# Altium schematic sheet CAN.SchDoc
size A4; SheetNumber: 5; SheetTotal: 6
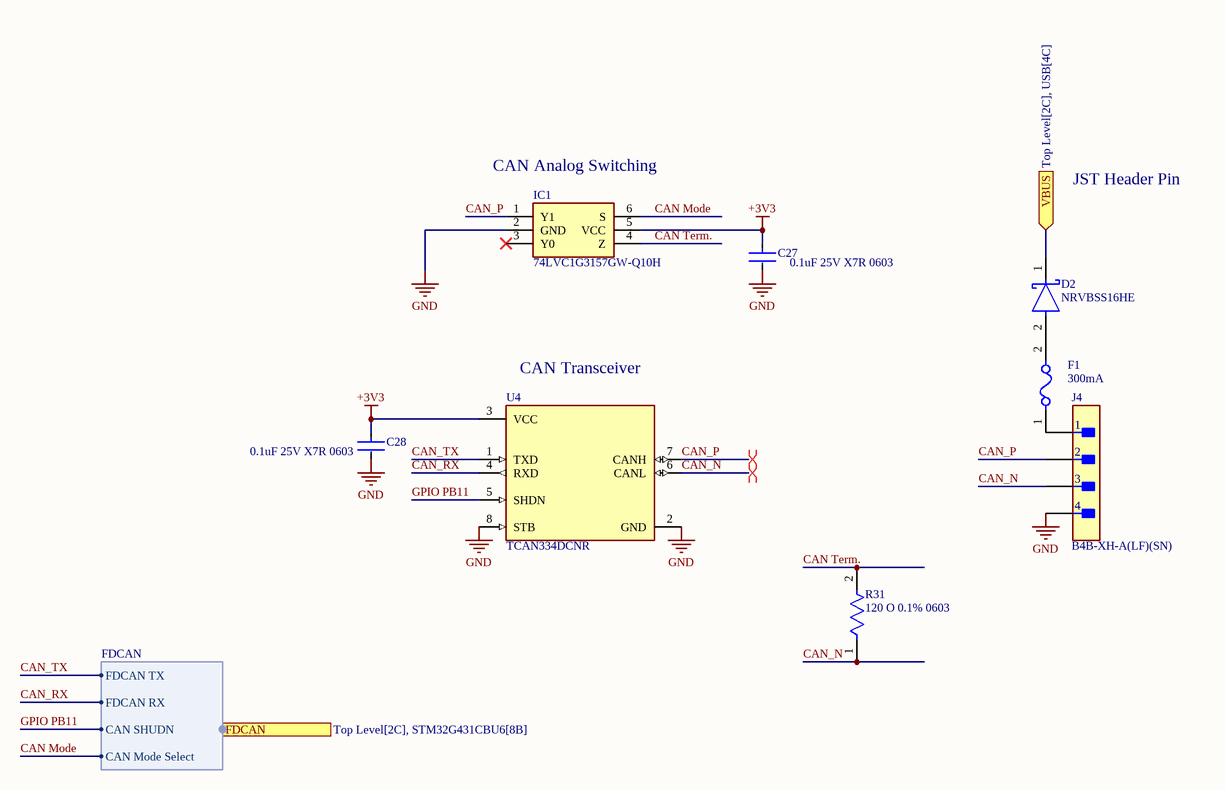
[diagram p0: CAN.SchDoc]

## Parts
C27  0.1uF 25V X7R 0603  [FP-C0603C-CF-MFG]
C28  0.1uF 25V X7R 0603  [FP-C0603C-CF-MFG]
D2  NRVBSS16HE  [FP-477AD-MFG]
F1  300mA  [FP-0805L010-MFG]
IC1  74LVC1G3157GW-Q10H  [SOT65P210X110-6N]
J4  B4B-XH-A(LF)(SN)  [FP-B4B-XH-A_LF_SN-MFG]
R31  120 O 0.1% 0603  [FP-RT0603-MFG]
U4  TCAN334DCNR  [FP-DCN0008A-IPC_C]

## Ports
FDCAN (harness FDCAN, see Top Level[2C], STM32G431CBU6[8B]), VBUS (in, see Top Level[2C], USB[4C])

## Harnesses
FDCAN: FDCAN TX, FDCAN RX, CAN SHUDN, CAN Mode Select

## Nets
+3V3: C27.1 C28.1 IC1.5(VCC) U4.3(VCC)
GND: C27.2 C28.2 IC1.2(GND) J4.4 U4.2(GND) U4.8(STB)
CAN Mode: IC1.6(S) ; port FDCAN.CAN Mode Select
CAN Term.: IC1.4(Z) R31.2
CAN_N: J4.3 R31.1 U4.6(CANL)
CAN_P: IC1.1(Y1) J4.2 U4.7(CANH)
CAN_RX: U4.4(RXD) ; port FDCAN.FDCAN RX
CAN_TX: U4.1(TXD) ; port FDCAN.FDCAN TX
GPIO PB11: U4.5(SHDN) ; port FDCAN.CAN SHUDN
VBUS: D2.1(C) ; port VBUS
NetD2_2: D2.2(A) F1.2
NetF1_1: F1.1 J4.1

Not connected (* = marked no-connect by the designer): IC1 3(Y0)*

## Layout directives
differential pair: CAN_N, CAN_P

## Notes on the sheet
- (near IC1) CAN Analog Switching
- JST Header Pin
- (near U4) CAN Transceiver

## Library data of the parts
C27 C28 = CMP-2006-03731-2: CAP CER 0.1UF 25V X7R 0603; Manufacturer Part Number: C0603C104K3RACAUTO; Manufacturer: KEMET; Capacitance: 0.10 μF; Automotive Grade: Grade 1; Tolerance: 0.1; Material: Ceramic; Temperature Coefficient: 30ppm/°C; Value: 0.10 μF; Digikey Description: CAP CER 0.1UF 25V X7R 0603; RoHS: TRUE; ComponentLink2Description: Datasheet; Temperature Range High: +125°C; Temperature Characteristic: X7R; Automotive: Yes; Package: C0603C-CF; ComponentLink2URL: https://api.kemet.com/component-edge/download/datasheet/C0603C100J5GACAUTO.pdf; Lead Free: Yes; Device Class L2: Capacitors; Device Class L3: Ceramic Capacitors; Device Class L1: Passive Components; Octopart: https://octopart.com/c0603c104k3racauto-kemet-12595587; Height: 0.87mm; Mouser Description: Multilayer Ceramic Capacitors MLCC - SMD/SMT 0.1uF 25volts 10% X7R AUTO; Category: Cap; Voltage Rating: 25 V; Temperature Range Low: -55°C; Temperature: -55°C to +125°C
D2 = CMP-00278-93203857-1: NRVBSS16HE Rectifier Diode, Schottky, 1 Phase, 1 Element, 1A, 60V V(RRM), Silicon; Manufacturer Lifecycle Status: ACTIVE; Capacitance: 43pF; Max Forward Surge Current (Ifsm): 25A; Peak Reverse Current: 2µA; Max Junction Temperature (Tj): 150°C; Max Operating Temperature: 150°C; Reverse Voltage: 60V; Forward Current: 1A; Height: 750µm; Lifecycle Status: Production; RoHS: Compliant; Min Operating Temperature: -55°C; Max Repetitive Reverse Voltage (Vrrm): 60V; NexarPartId: 93203857
F1 = CMP-00227-00673855-1: 0805L010YR PTC Resettable Fuse 0.1A(hold) 0.3A(trip) 15VDC 100A 0.5W 1.5s 1Ohm SMD Solder Pad 0805 T/R; NexarPartId: 673855; Minimum Resistance Initial (Rmin): 1Ω; Maximum Resistance 1 Hour (R1max): 6Ω; Power Dissipation: 500mW; Working Voltage: 15V; Hold Current: 100mA; Approvals: TUV, cULus; Min Operating Temperature: -40°C; Max Current Rating: 100A; Case Code (Imperial): 0805; Termination: SMD/SMT; Height: 1mm; Resistance: 6Ω; Case Code (Metric): 2012; Lifecycle Status: Production; Operating Supply Voltage: 15V; Mount: Surface Mount; Voltage Rating: 15V; RoHS: Compliant; Width: 1.5mm; Length: 2.2mm; Voltage Rating (DC): 15V; Time to Trip: 1.5s; Ambient Temperature Range High: 85°C; Max Power Dissipation: 500mW; Trip Current: 300mA; Lead Free: Lead Free; Max Operating Temperature: 85°C; Current Rating: 100A; Terminal Material: Copper; Packaging: Cut Tape; REACH SVHC: No SVHC; Max Voltage Rating (DC): 15V; Case/Package: 0805
IC1 = 74LVC1G3157GW-Q10H: Integrated Circuit; Manufacturer_Name: Nexperia; Datasheet Link: https://assets.nexperia.com/documents/data-sheet/74LVC1G3157_Q100.pdf; Height: 1.1mm; Manufacturer_Part_Number: 74LVC1G3157GW-Q10H; Mouser Part Number: 771-74LVC1G3157GWQ10; Mouser Price/Stock: https://www.mouser.co.uk/ProductDetail/Nexperia/74LVC1G3157GW-Q10H?qs=5XOdhvmYM0OEi4hrMRn80A%3D%3D; Arrow Part Number: 74LVC1G3157GW-Q10H; Arrow Price/Stock: https://www.arrow.com/en/products/74lvc1g3157gw-q10h/nexperia?utm_currency=USD&region=nac
J4 = CMP-17439-000250-1: CONN HEADER VERT 4POS 2.5MM; Number of Contacts: 4; Contact Resistance: 20mR; Voltage Rating: 250V; Max Current Rating: 3A; Gender: Male; Wire/Cable Gauge: 22AWG; Mated Stacking Heights: 9.8mm; Insulation Resistance: 1GR; Orientation: Straight; Contact Type: Male Pin; Contact Finish - Mating: TIN; Series: XH; Max Voltage Rating (AC): 250V; Lead Pitch: 2.5mm; Contact Shape: Square; Insulation Color: Natural; Termination: Solder; Lead Free: Lead Free; Voltage Rating (AC): 250V; Number of Rows: 1; Flammability Rating: UL94 V-0; Number of Positions: 4; Max Operating Temperature: 85°C; Package Quantity: 500; Mount: Through Hole; REACH SVHC: No SVHC; Connector Type: Header; Insulation Material: Nylon; Fastening Type: Detent; Min Operating Temperature: -25°C; Housing Color: White; Packaging: Bulk; Contact Plating: Tin; Contact Material: Brass; Max Voltage Rating (DC): 250V; Housing Material: Polyamide; Color: Natural; Material: Polyamide; Pitch: 2.5mm; Depth: 5.75mm; Current Rating: 3A; Length: 12.4mm
R31 = CMP-03412-006948-1: RES SMD 120 OHM 0.1% 1/10W 0603; Manufacturer Part Number: RT0603BRC07120RL; Manufacturer: Yageo; Value: 120Ω; Tolerance: 0.001; Power Rating: 0.1W; Voltage Rating: 75V; Temperature Coefficient: 15 ppm/°C; Height: 0.55mm; Temperature: -55°C to +155°C; Ipc Land Pattern Name: RESC16080X45; ComponentLink2URL: http://www.yageo.com/documents/recent/PYu-RT_1-to-0.01_RoHS_L_9.pdf; Resistance: 120Ω; Lead Free: Yes; Digikey Description: RES SMD 120 OHM 0.1% 1/10W 0603; Series: RT; Package: RT0603; RoHS: TRUE; Footprint Url: http://www.yageo.com/exep/pages/download/literatures/PYu-R_Mount_10.pdf; Automotive: No; Device Class L3: Chip SMD Resistors; Temperature Range High: +155°C; Device Class L1: Passive Components; Octopart: https://octopart.com/rt0603brc07120rl-yageo-56543448; Composition: Thin Film; Temperature Range Low: -55°C; Category: Res; Device Class L2: Resistors; ComponentLink2Description: Datasheet
U4 = CMP-04872-000047-1: IC TRANSCEIVER 1/1 SOT23-8; Receiver Hysteresis: 120mV; Data Rate: 1Mbps; RoHS Compliant: Yes; Max Operating Temperature: 125°C; Min Operating Temperature: -40°C; Mount: Surface Mount; Packaging: Cut Tape; Lead Free: Lead Free; Case/Package: SOT-23-8